# Altium schematic sheet FPGA_GTP.SchDoc: Phaser
size 420 x 297 mm; EDA_Number: ARTIQ; Projet: ARTIQ/SINARA; Author: G.Kasprowicz; CompanyName: WUT ISE; DrawnBy: G.Kasprowicz; Organization: WUT ISE; Address1: PW ISE; Address2: Nowowiejska 15/19 00-665 Warsaw; Address3: gkasprow@gmail.com; DocumentNumber: 13; Revision: 2; SheetNumber: 13; SheetTotal: 18; ModifiedBy: -; CheckedDate: -; Title2: GTP & SATA; DivGrp: WUT ISE; Designer: G.Kasprowicz; ModifiedDate: -; ProjectName: Sensor Box
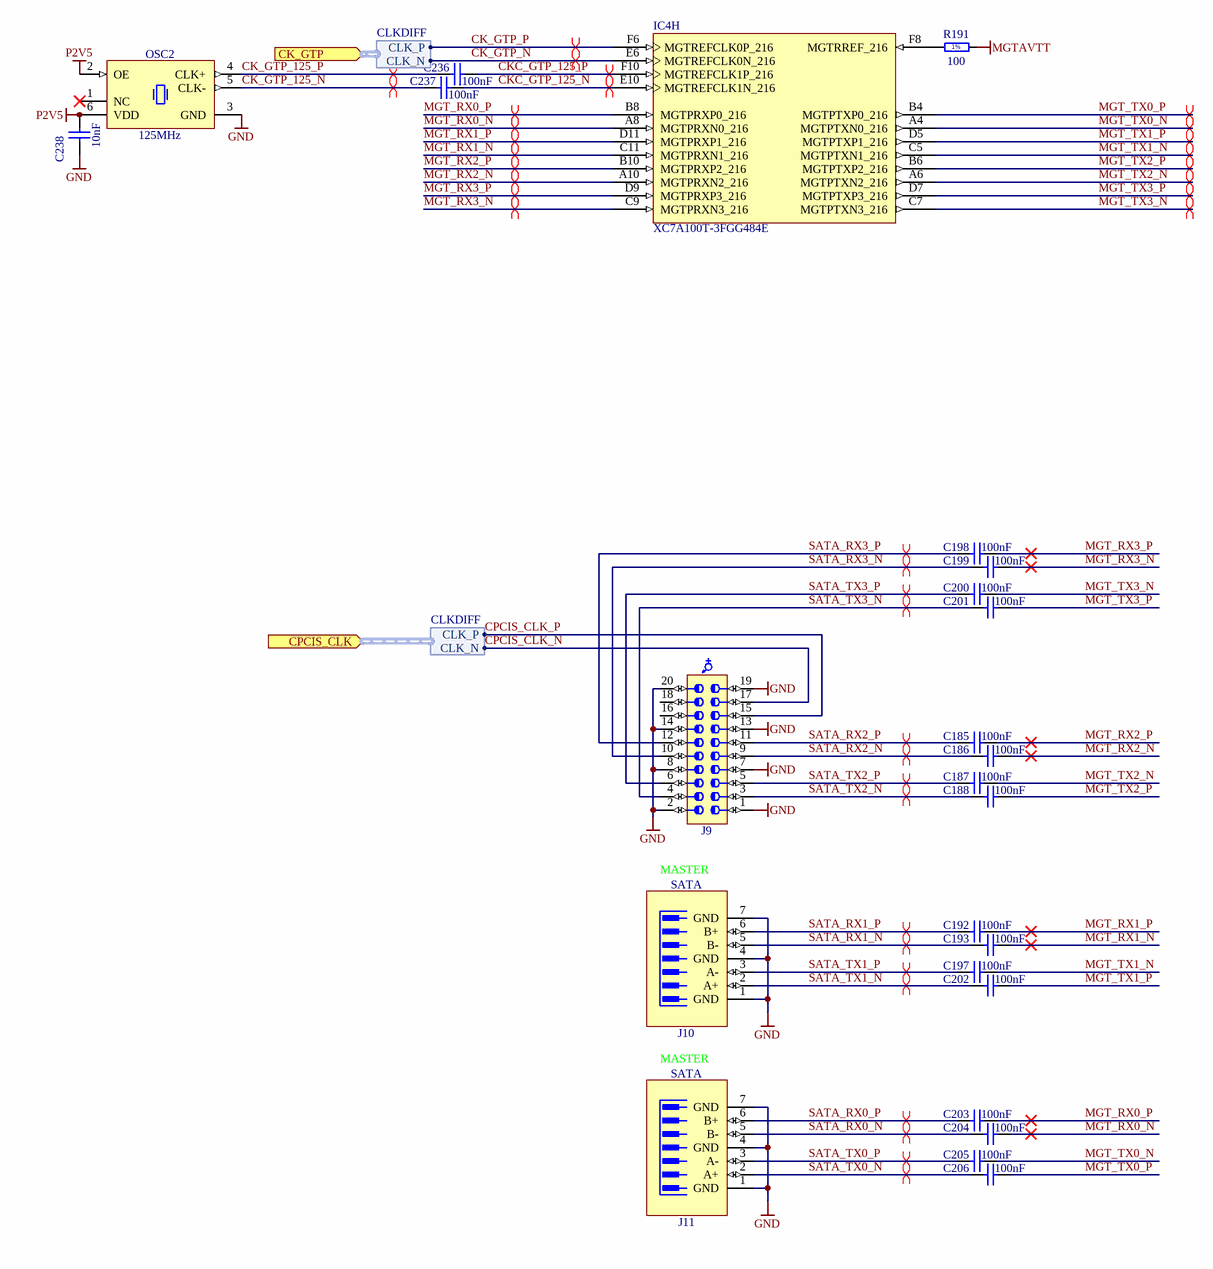
[diagram p0: FPGA_GTP.SchDoc]

## Parts
C185  100nF  [CAPC0603X33N]
C186  100nF  [CAPC0603X33N]
C187  100nF  [CAPC0603X33N]
C188  100nF  [CAPC0603X33N]
C192  100nF  [CAPC0603X33N]
C193  100nF  [CAPC0603X33N]
C197  100nF  [CAPC0603X33N]
C198  100nF  [CAPC0603X33N]
C199  100nF  [CAPC0603X33N]
C200  100nF  [CAPC0603X33N]
C201  100nF  [CAPC0603X33N]
C202  100nF  [CAPC0603X33N]
C203  100nF  [CAPC0603X33N]
C204  100nF  [CAPC0603X33N]
C205  100nF  [CAPC0603X33N]
C206  100nF  [CAPC0603X33N]
C236  100nF  [CAPC0603X33N]
C237  100nF  [CAPC0603X33N]
C238  10nF  [CAPC1005X55N]
IC4  XC7A100T-3FGG484E  [FGG484]  (part H of 10)
J9  (no value)  [SAMTEC_LSS-110-01-L-DV-A]
J10  SATA  [MOLEX_67800-5005]
J11  SATA  [MOLEX_67800-5005]
OSC2  125MHz  [OSC_SILICON-LAB_SI510-6N]
R191  100  [RESC1005X40N]

## Ports
CK_GTP (in, harness CLKDIFF), CPCIS_CLK (in, harness CLKDIFF)

## Harnesses
CLKDIFF: CLK_N, CLK_P

## Nets
GND: C238.1 J9.1 J9.2 J9.7 J9.8 J9.13 J9.14 J9.19 J9.20 J10.1(GND) J10.4(GND) J10.7(GND) J11.1(GND) J11.4(GND) J11.7(GND) OSC2.3(GND)
MGTAVTT: R191.1
P2V5: C238.2 OSC2.2(OE) OSC2.6(VDD)
CK_GTP_125_N: C237.1 OSC2.5(CLK-)
CK_GTP_125_P: C236.1 OSC2.4(CLK+)
CK_GTP_N: IC4.E6(MGTREFCLK0N_216) ; port CK_GTP.CLK_N
CK_GTP_P: IC4.F6(MGTREFCLK0P_216) ; port CK_GTP.CLK_P
CKC_GTP_125_N: C237.2 IC4.E10(MGTREFCLK1N_216)
CKC_GTP_125_P: C236.2 IC4.F10(MGTREFCLK1P_216)
CPCIS_CLK_N: J9.17 ; port CPCIS_CLK.CLK_N
CPCIS_CLK_P: J9.15 ; port CPCIS_CLK.CLK_P
MGT_RX0_N: C204.2 IC4.A8(MGTPRXN0_216)
MGT_RX0_P: C203.2 IC4.B8(MGTPRXP0_216)
MGT_RX1_N: C193.2 IC4.C11(MGTPRXN1_216)
MGT_RX1_P: C192.2 IC4.D11(MGTPRXP1_216)
MGT_RX2_N: C186.2 IC4.A10(MGTPRXN2_216)
MGT_RX2_P: C185.2 IC4.B10(MGTPRXP2_216)
MGT_RX3_N: C199.2 IC4.C9(MGTPRXN3_216)
MGT_RX3_P: C198.2 IC4.D9(MGTPRXP3_216)
MGT_TX0_N: C205.2 IC4.A4(MGTPTXN0_216)
MGT_TX0_P: C206.2 IC4.B4(MGTPTXP0_216)
MGT_TX1_N: C197.2 IC4.C5(MGTPTXN1_216)
MGT_TX1_P: C202.2 IC4.D5(MGTPTXP1_216)
MGT_TX2_N: C187.2 IC4.A6(MGTPTXN2_216)
MGT_TX2_P: C188.2 IC4.B6(MGTPTXP2_216)
MGT_TX3_N: C200.2 IC4.C7(MGTPTXN3_216)
MGT_TX3_P: C201.2 IC4.D7(MGTPTXP3_216)
SATA_RX0_N: C204.1 J11.5(B-)
SATA_RX0_P: C203.1 J11.6(B+)
SATA_RX1_N: C193.1 J10.5(B-)
SATA_RX1_P: C192.1 J10.6(B+)
SATA_RX2_N: C186.1 J9.9
SATA_RX2_P: C185.1 J9.11
SATA_RX3_N: C199.1 J9.10
SATA_RX3_P: C198.1 J9.12
SATA_TX0_N: C206.1 J11.2(A+)
SATA_TX0_P: C205.1 J11.3(A-)
SATA_TX1_N: C202.1 J10.2(A+)
SATA_TX1_P: C197.1 J10.3(A-)
SATA_TX2_N: C188.1 J9.3
SATA_TX2_P: C187.1 J9.5
SATA_TX3_N: C201.1 J9.4
SATA_TX3_P: C200.1 J9.6
NetIC4_F8: IC4.F8(MGTRREF_216) R191.2

Not connected (* = marked no-connect by the designer): J9 16 18; OSC2 1(NC)*

## Layout directives
differential pair: CK_GTP_N, CK_GTP_P
differential pair; net class Diff_100Ohm; differential pair class Diff_100Ohm: CK_GTP_125_N, CK_GTP_125_P, CKC_GTP_125_N, CKC_GTP_125_P, MGT_RX0_N, MGT_RX0_P, MGT_RX1_N, MGT_RX1_P, MGT_RX2_N, MGT_RX2_P, MGT_RX3_N, MGT_RX3_P, MGT_TX0_N, MGT_TX0_P, MGT_TX1_N, MGT_TX1_P, MGT_TX2_N, MGT_TX2_P, MGT_TX3_N, MGT_TX3_P, SATA_RX0_N, SATA_RX0_P, SATA_RX1_N, SATA_RX1_P, SATA_RX2_N, SATA_RX2_P, SATA_RX3_N, SATA_RX3_P, SATA_TX0_N, SATA_TX0_P, SATA_TX1_N, SATA_TX1_P, SATA_TX2_N, SATA_TX2_P, SATA_TX3_N, SATA_TX3_P

## Notes on the sheet
- MASTER
- Project/Equipment
- Document
- Designer
- Drawn by
- Check.by
- Copyright WUT ISE 2018.
  This documentation describes Open Hardware and is licensed under the CERN OHL v.1.1. You may redistribute and modify this documentation under the terms of the CERN OHL v.1.1. (http://ohwr.org/CERNOHL). This documentation is distributed WITHOUT ANY EXPRESS OR IMPLIED WARRANTY, INCLUDING OF MERCHANTABILITY, SATISFACTORY QUALITY AND FITNESS FOR A PARTICULAR PURPOSE. Please see the CERN OHL v.1.1 for applicable conditions.
- Contact
- File
- Last Mod.
- Print Date
- Sheet
- Size
- A3
- of
- Rev
- (in symbol R0402_100R_1%_0.0625W_100PPM) 1%

## Library data of the parts
C185-C188 C192 C193 C197-C206 C236 C237 = CC0201_100NF_6.3V_10%_X5R: Non-polarised capacitor; Part Description: SMD Multilayer Chip Ceramic Capacitor; Manufacturer: GENERIC; Manufacturer1 Part Number: 02016D104KAT2A; Voltage: 6.3V; TC: X5R; Tolerance: ±10%; Part Number: CC0201_100NF_6.3V_10%_X5R; Component Kind: Standard; Component Type: Standard; Pin Count: 2; Value: 100nF; Status: Not Recommended; Manufacturer Part Number: CC0201_100NF_6.3V_10%_X5R; Case: 0201; Mounted: Yes; Socket: No; SMD: Yes; Sense: No; Manufacturer1 Example: AVX; Manufacturer1 ComponentHeight: 0.33mm; HelpURL: \\cern.ch\dfs\Applications\Altium\Datasheets\CC0201_X5R_AVX.pdf; Author: CERN DEM JLC; CreateDate: 2007-12-03; LatestRevisionDate: 2007-12-03
  C185-C188 C192 C193 C197-C206: ClassName: SATA
C238 = CC0402_10NF_16V_10%_X7R: Non-polarised capacitor; Part Description: SMD Multilayer Chip Ceramic Capacitor; Manufacturer: GENERIC; Manufacturer1 Part Number: 223878715636; Voltage: 16V; TC: X7R; Tolerance: ±10%; Part Number: CC0402_10NF_16V_10%_X7R; Component Kind: Standard; Component Type: Standard; Pin Count: 2; Value: 10nF; Status: Not Recommended; Manufacturer Part Number: CC0402_10NF_16V_10%_X7R; Case: 0402; Mounted: Yes; Socket: No; SMD: Yes; Sense: No; Manufacturer1 Example: PHYCOMP; Manufacturer1 ComponentHeight: 0.55mm; HelpURL: \\cern.ch\dfs\Applications\Altium\Datasheets\CC0402_X7R_PHYCOMP.pdf; Author: CERN DEM JLC; CreateDate: 03.12.2007; LatestRevisionDate: 03.12.2007
IC4 = CMP-0364-00028-3: Artix-7 FPGA, 285 User I/Os, 4 GTP, 484-Ball BGA, Speed Grade 3, Extended Grade, Pb-Free; Manufacturer: Xilinx; Max User I/O: 300; Clock Mgmt Tiles (CMTs): 6; Logic Cells: 101440; Block RAM Blocks (36Kb): 135; Block RAM Blocks (18Kb): 270; Speed Grade: -3; CLBs (Slices): 15850; Block RAM Blocks (Max Kb): 4860; DSP48E1 Slices: 240; RoHS: Pb-Free; ComponentLink3URL: http://www.xilinx.com/support/documentation/data_sheets/ds181_Artix_7_Data_Sheet.pdf; NexusDeviceID: XC7A100T-3FGG484E; DatasheetVersion: v1.12; Mounting Technology: Surface Mount; PackageDescription: Wire-Bond Fine-Pitch BGA, Body 23 x 23 mm, 1.0 mm Pitch; PackageReference: FGG484; ComponentLink2Description: Package Specification; Code_JEDEC: MS-034-AAJ-1; ComponentLink2URL: http://www.xilinx.com/support/documentation/user_guides/ug475_7Series_Pkg_Pinout.pdf; ComponentLink3Description: DC and Switching Characteristics; Generic Part Number: XC7A100T; ComponentLink4Description: Package File; ComponentLink4URL: http://www.xilinx.com/support/packagefiles/a7packages/xc7a100tfgg484pkg.txt; ComponentLink1URL: http://www.xilinx.com/support/documentation/data_sheets/ds180_7Series_Overview.pdf; PartNumber: XC7A100T-3FGG484E; ComponentLink5URL: http://www.xilinx.com/support/documentation/user_guides/ug475_7Series_Pkg_Pinout.pdf; PackageVersion: Rev 1.8; ComponentLink5Description: Packaging and Pinout; ComponentLink1Description: Datasheet; CLBs (Max Distributed RAM Kb): 1188
J9 = SAMTEC_LSS-110-01-L-DV-A: Connector 20 Hermaphroditic; Part Description: 20 Contacts, Pitch 0.635mm, Razor Beam LSS Vertical High Speed Hermaphroditic Strip (Lead Style 4.5mm); Manufacturer: SAMTEC; PressFit: No; Part Number: SAMTEC_LSS-110-01-L-DV-A; Component Kind: Standard; Component Type: Standard; Pin Count: 20; Mounted: Yes; Socket: No; Sense: No; SMD: Yes; Status: None; Manufacturer Part Number: LSS-110-01-L-DV-A; ComponentHeight: 4.57mm; HelpURL: \\cern.ch\dfs\Applications\Altium\Datasheets\SAMTEC_LSS-110-01-L-DV-A.pdf; Author: CERN DEM MR; CreateDate: 07.03.2016; LatestRevisionDate: 07.03.2016
J10 J11 = MOLEX_67800-5005: 7 Pin SATA Receptacle; Part Description: 1.27mm Pitch, 7 Contacts, Serial ATA High Speed Header, Straight with Locking Latch; Manufacturer: MOLEX; PressFit: No; Part Number: MOLEX_67800-5005; Component Kind: Standard; Component Type: Standard; Pin Count: 7; Family: SATA; Mounted: Yes; Socket: No; SMD: Yes; Sense: No; Status: None; Manufacturer Part Number: 67800-5005; ComponentHeight: 8.4mm; HelpURL: \\cern.ch\dfs\Applications\Altium\Datasheets\MOLEX_67800-5005.pdf; Author: CERN DEM MR; CreateDate: 01.12.2016; LatestRevisionDate: 01.12.2016; ClassName: SATA
OSC2 = OSC_125MHZ_SILICON-LAB_510FBA125M000AAG: Crystal Oscillator 6 pins, Si510 (LVDS/LVPECL/HCSL/Dual CMOS); Part Description: 2.5V ±25ppm LVDS Crystal Oscillator (XO), Si510 Series; Manufacturer: SILICON LABS; PressFit: No; Bonding: No; Part Number: OSC_125MHZ_SILICON-LAB_510FBA125M000AAG; Component Kind: Standard; Component Type: Standard; PackageDescription: Oscillator Si510 Series, 6 pins, 5x7mm; Value: 125MHz; Manufacturer Part Number: 510FBA125M000AAG; Pin Count: 6; Mounted: Yes; Socket: No; SMD: Yes; Sense: No; ComponentHeight: 1.8mm; HelpURL: \\cern.ch\dfs\Applications\Altium\Datasheets\OSC_SILICON-LAB_SI510.pdf; Author: CERN DEM JMW; CreateDate: 2015-08-10; LatestRevisionDate: 2015-08-10
R191 = R0402_100R_1%_0.0625W_100PPM: Resistor - 1%; Part Description: General Purpose Thick Film Chip Resistor; Manufacturer: GENERIC; Manufacturer1 Part Number: 232270671001L; TC: ±100ppm/°C; PressFit: No; Part Number: R0402_100R_1%_0.0625W_100PPM; Component Kind: Standard; Component Type: Standard; Pin Count: 2; Value: 100; Status: Not Recommended; Power: 0.0625W; Tolerance: ±1%; Manufacturer Part Number: R0402_100R_1%_0.0625W_100PPM; Case: 0402; Mounted: Yes; Sense: No; Socket: No; SMD: Yes; Manufacturer1 Example: YAGEO PHYCOMP; Manufacturer1 ComponentHeight: 0.4mm; HelpURL: \\cern.ch\dfs\Applications\Altium\Datasheets\R0402_Phycomp_RC0402.pdf; Author: CERN DEM JLC; CreateDate: 03.12.2007; LatestRevisionDate: 17.10.2012; ClassName: Artix